# EAGLE design buckconverterhr (EAGLE 6.6.0)
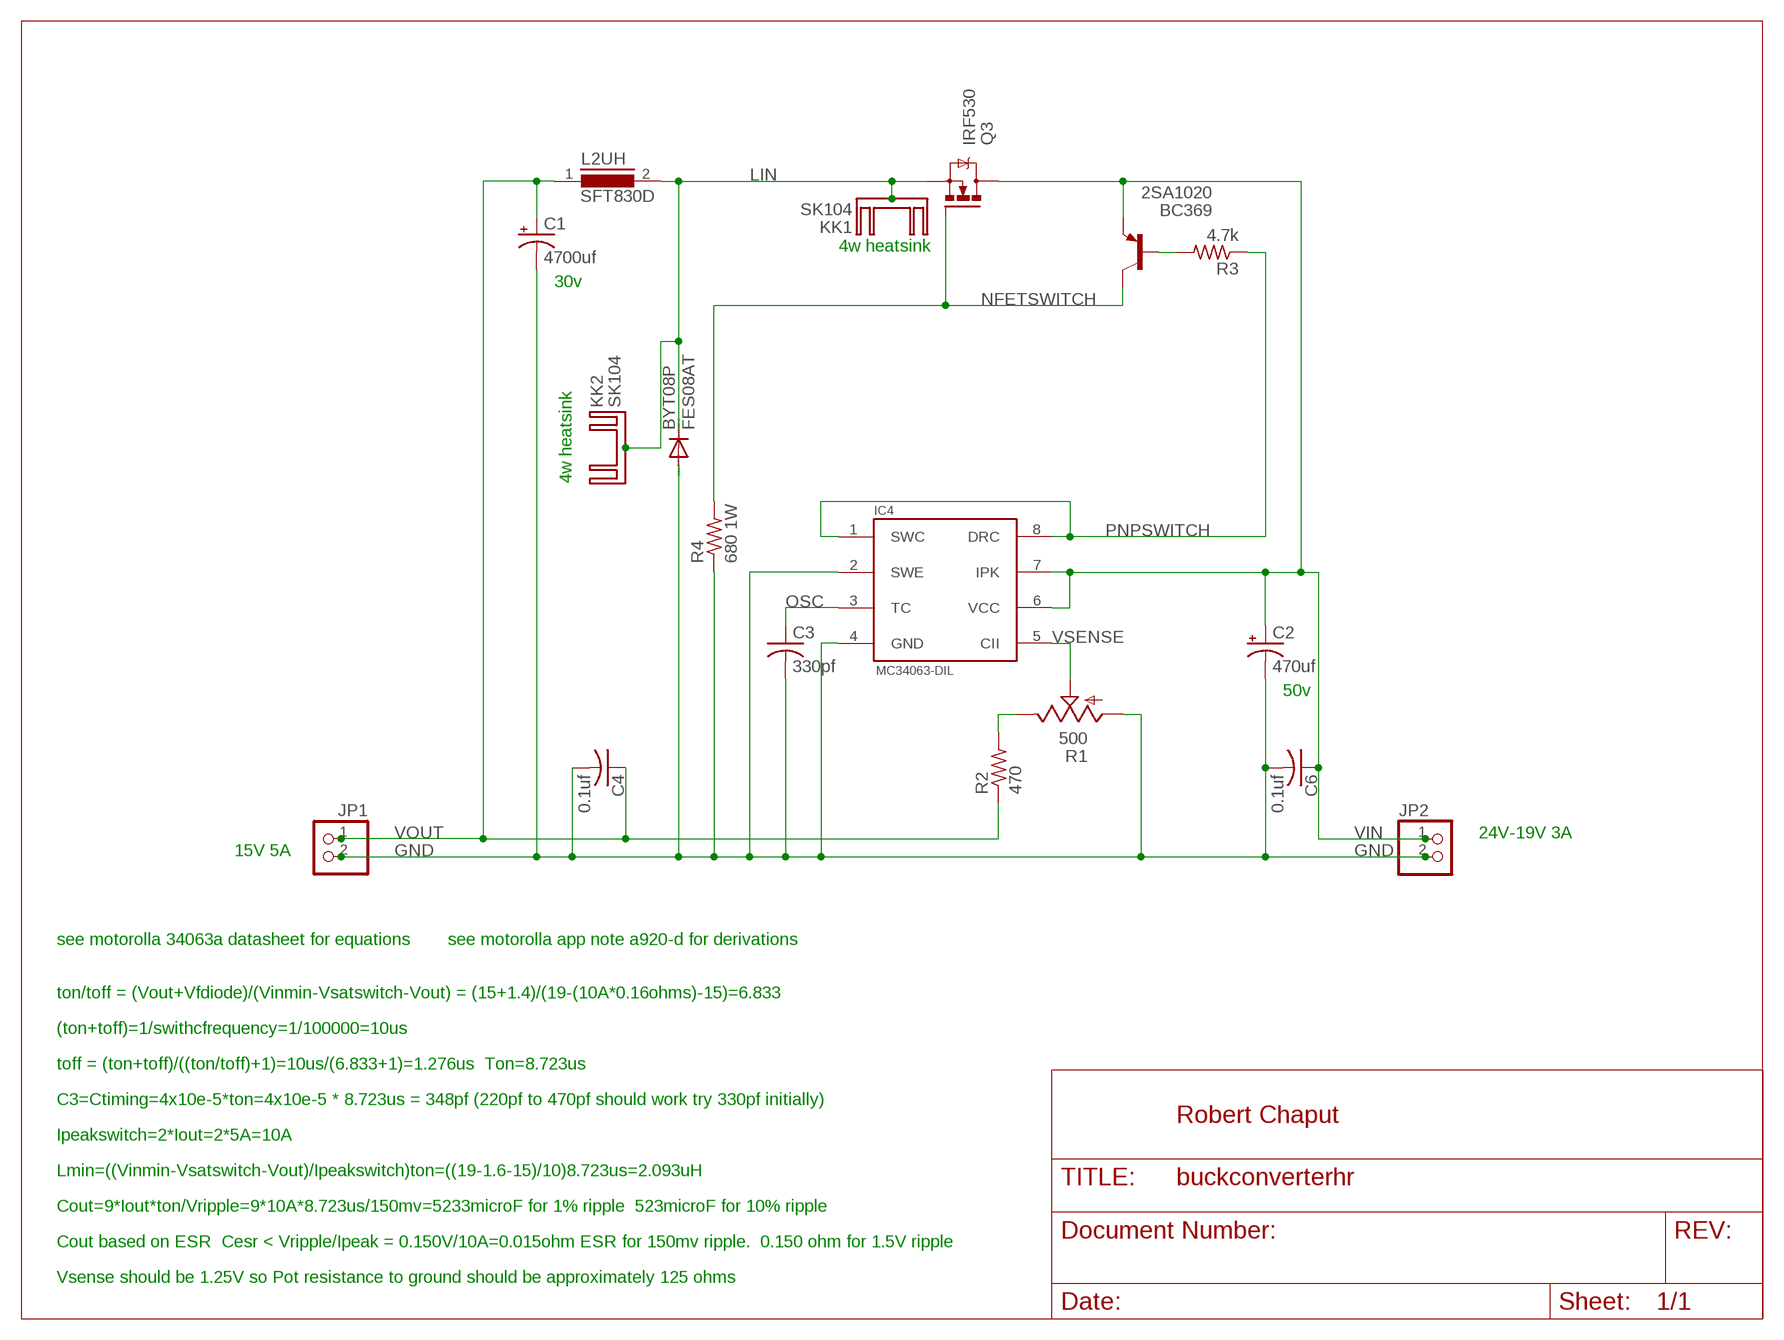
[diagram p0: schematic, sheet 1]

## Parts
2SA1020  BC369  [TO92-BCE]
BYT08P  FES08AT  [DO220S]
C1  4700uf  CPOL-USE10-30  [EB30D]
C2  470uf  CPOL-USE5-8.5  [E5-8,5]
C3  330pf  C-US050-030X075  [C050-030X075]
C4  0.1uf  C-US050-030X075  [C050-030X075]
C6  0.1uf  C-US050-030X075  [C050-030X075]
IC4  MC34063-DIL  [DIL08]
JP1  PINHD-1X2  [1X02]
JP2  PINHD-1X2  [1X02]
KK1  SK104  [SK104]
KK2  SK104  [SK104]
L2UH  SFT830D  [SFT830D]
Q3  IRF530  [TO220BV]
R1  500  TRIM_US-PTSPIN  [PT-SPIN]
R2  470  R-US_0309/V  [0309V]
R3  4.7k  R-US_0309/V  [0309V]
R4  680 1W  R-US_0613/5V  [P0613V]

## Nets
GND: BYT08P.A C1.- C2.- C3.2 C4.2 C6.2 IC4.2(SWE) IC4.4(GND) JP1.2 JP2.2 R1.A R4.1
LIN: BYT08P.C L2UH.2 Q3.S
N$1: R1.E R2.2
N$8: 2SA1020.B R3.2
NFETSWITCH: 2SA1020.C Q3.G R4.2
OSC: C3.1 IC4.3(TC)
PNPSWITCH: IC4.1(SWC) IC4.8(DRC) R3.1
VIN: 2SA1020.E C2.+ C6.1 IC4.6(VCC) IC4.7(IPK) JP2.1 Q3.D
VOUT: C1.+ C4.1 JP1.1 L2UH.1 R2.1
VSENSE: IC4.5(CII) R1.S

## Notes on the sheet
- 4w heatsink
- 30v
- 4w heatsink
- 50v
- 24V-19V 3A
- 15V 5A
- see motorolla 34063a datasheet for equations | see motorolla app note a920-d for derivations
- ton/toff = (Vout+Vfdiode)/(Vinmin-Vsatswitch-Vout) = (15+1.4)/(19-(10A*0.16ohms)-15)=6.833
- (ton+toff)=1/swithcfrequency=1/100000=10us
- toff = (ton+toff)/((ton/toff)+1)=10us/(6.833+1)=1.276us  Ton=8.723us
- C3=Ctiming=4x10e-5*ton=4x10e-5 * 8.723us = 348pf (220pf to 470pf should work try 330pf initially)
- Robert Chaput
- Ipeakswitch=2*Iout=2*5A=10A
- Lmin=((Vinmin-Vsatswitch-Vout)/Ipeakswitch)ton=((19-1.6-15)/10)8.723us=2.093uH
- Cout=9*Iout*ton/Vripple=9*10A*8.723us/150mv=5233microF for 1% ripple  523microF for 10% ripple
- Cout based on ESR  Cesr < Vripple/Ipeak = 0.150V/10A=0.015ohm ESR for 150mv ripple.  0.150 ohm for 1.5V ripple
- Vsense should be 1.25V so Pot resistance to ground should be approximately 125 ohms

## Library data of the parts
2SA1020 = transistor-pnp:BC369*: PNP Transistror
BYT08P = diode:FES08AT: DIODE ultra-fast recovery rectifier
C1 C2 = rcl:CPOL-US: POLARIZED CAPACITOR, American symbol
C3 C4 C6 = rcl:C-US: CAPACITOR, American symbol
IC4 = mc34063:MC34063-DIL: DC/DC converter MC34063 in DIL08.
JP1 JP2 = pinhead:PINHD-1X2: PIN HEADER
KK1 KK2 = heatsink:SK104: HEATSINK manufacturer Fischer/distributor Buerklin
L2UH = inductors:SFT830D: INDUCTOR
Q3 = transistor-power:IRF530: HEXFET Power MOSFET
R1 = pot:TRIM_US-: POTENTIOMETER
R2-R4 = rcl:R-US_: RESISTOR, American symbol

## Net classes
0 default: width 1.27 mm

## Board
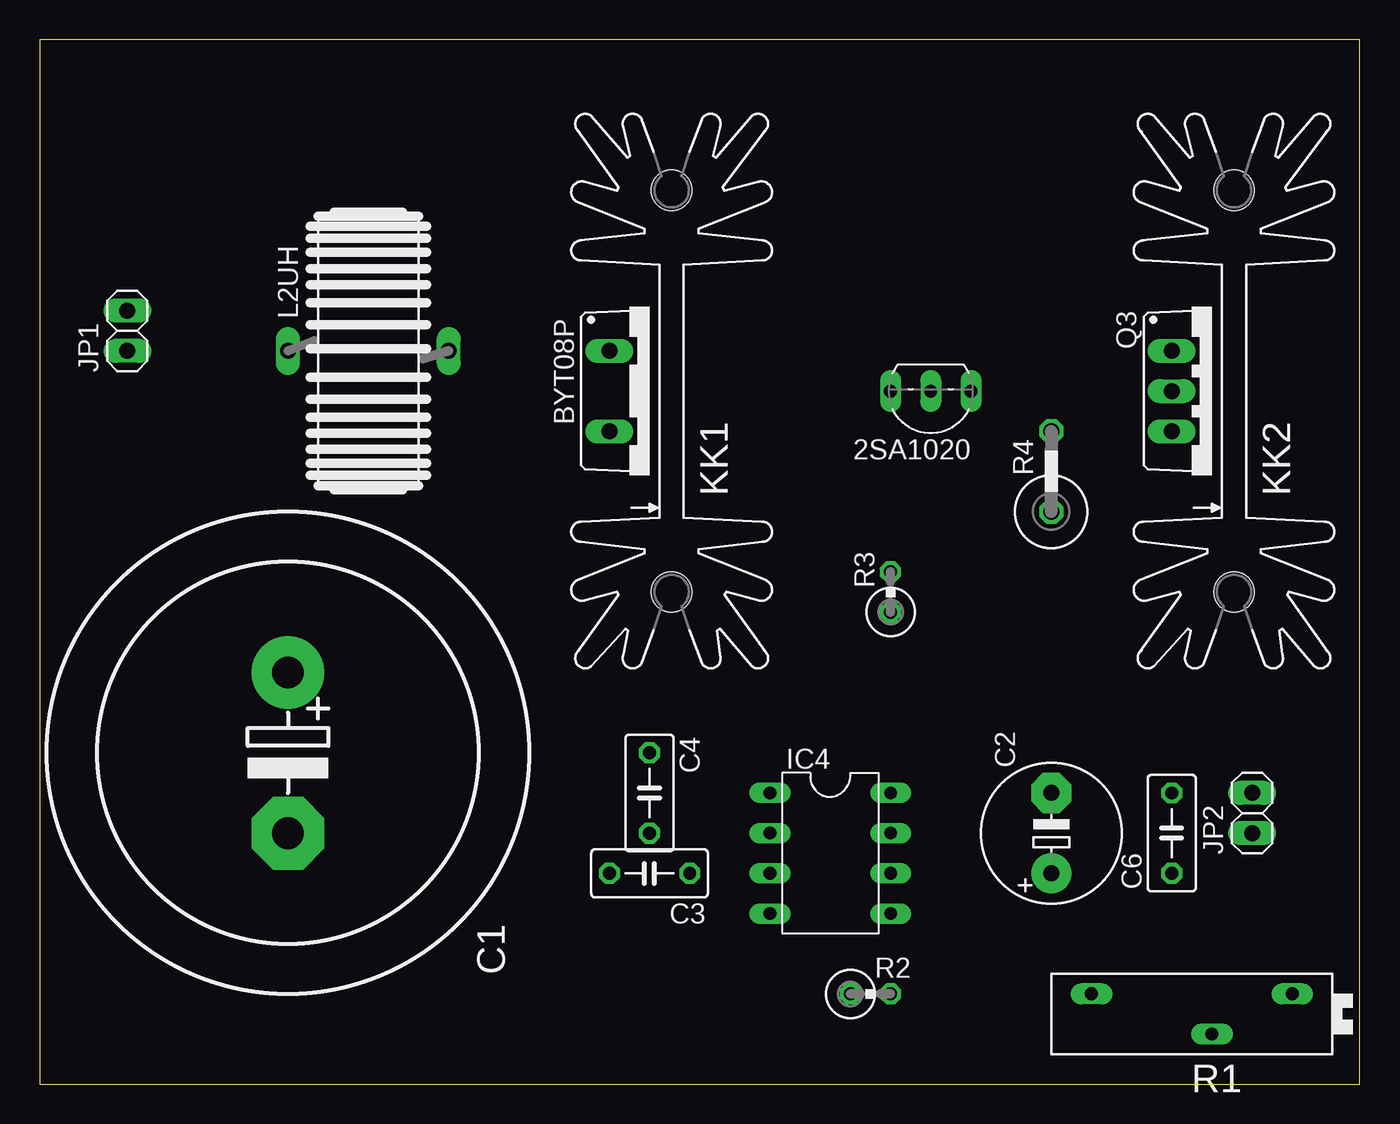
[diagram p1: board, top side]
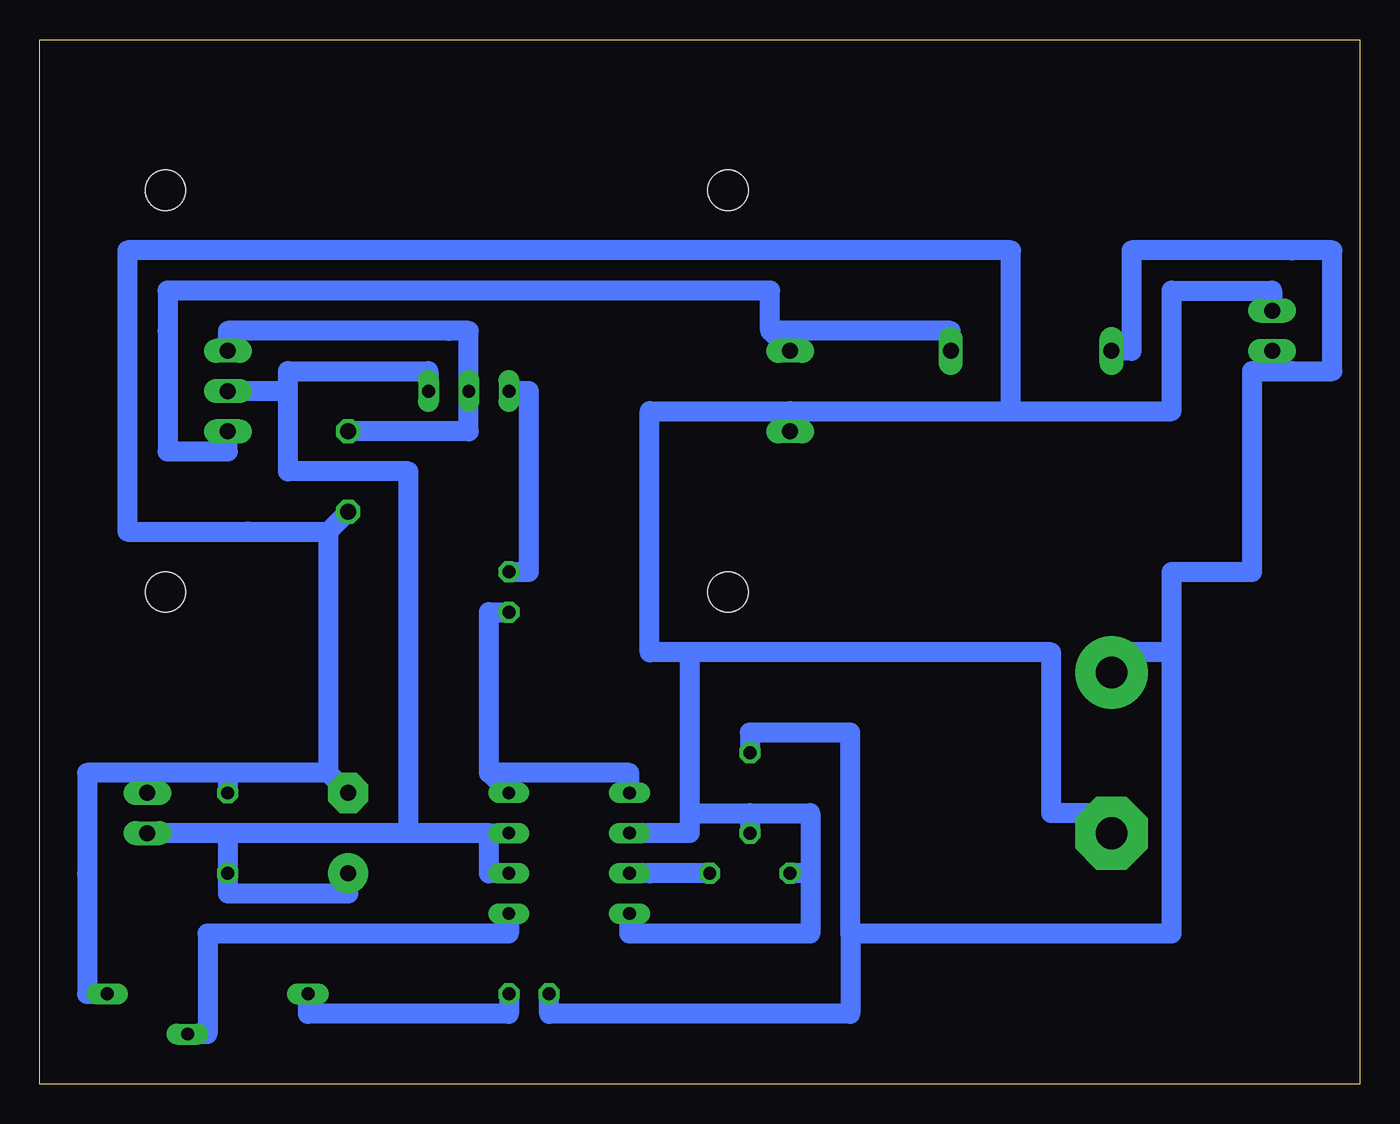
[diagram p2: board, bottom side, seen from below]

Size 83.49 x 66.03 mm. Coordinates in mm from the lower left corner, seen from the top.
Outline: 0,0 83.49,0 83.49,66.03 0,66.03 0,0
Copper layers (1*16): Top 0.035mm / dielectric 1.5mm / Bottom 0.035mm
Design rules "15mils": minimum track width 15mil, minimum drill 24mil, track to track 15mil, track to pad 10mil, pad to pad 10mil, via to via 10mil, smd to smd 10mil, copper to edge 13mil, drill to drill 10mil, minimum pad ring 10mil, minimum via ring 8mil, stop-mask expansion 0mil, vias tented up to drill 0mil, thermal gap 10mil

### Footprints (pad centres in the part's own frame; a part is rotated, then mirrored left to right if it is on the bottom)
TO92-BCE = drill 0.813 long: B 2.54,0; C 0,0; E -2.54,0
DO220S = drill 1.016 long: A 2.54,-2.54; C -2.54,-2.54
EB30D = drill 2.007 pad 4.597: + -5.08,0 | drill 2.007 pad 4.597 octagon: - 5.08,0
E5-8,5 = drill 1.016 pad 2.54: + -2.54,0 | drill 1.016 pad 2.54 octagon: - 2.54,0
C050-030X075 = drill 0.813 octagon: 1 -2.54,0; 2 2.54,0
DIL08 = drill 0.8 long: 1 -3.81,-3.81; 2 -1.27,-3.81; 3 1.27,-3.81; 4 3.81,-3.81; 5 3.81,3.81; 6 1.27,3.81; 7 -1.27,3.81; 8 -3.81,3.81
1X02 = drill 1.016 long: 1 -1.27,0; 2 1.27,0
SK104 = hole 2.54: -12.7,-0.762; 12.7,-0.762
SFT830D = drill 1.016 long: 1 -5.08,0; 2 5.08,0
TO220BV = drill 1.016 long: D 0,-2.54; G -2.54,-2.54; S 2.54,-2.54
PT-SPIN = drill 0.813 long: A -6.35,-1.27; E 6.35,-1.27; S -1.27,1.27
0309V = drill 0.813 octagon: 1 -1.27,0; 2 1.27,0
P0613V = drill 1.016 octagon: 1 -2.54,0; 2 2.54,0

### Placement (x,y rotation side)
2SA1020  56.35,43.81 180 top
BYT08P  38.57,43.81 270 top
C1  15.71,20.95 270 top
C2  63.97,15.87 90 top
C3  38.57,13.33 180 top
C4  38.57,18.41 270 top
C6  71.59,15.87 90 top
IC4  50,14.6 270 top
JP1  5.55,47.62 90 top
JP2  76.67,17.14 90 top
KK1  39.21,43.81 90 top
KK2  74.77,43.81 90 top
L2UH  20.79,46.35 0 top
Q3  74.13,43.81 270 top
R1  72.86,4.44 180 top
R2  52.54,5.71 0 top
R3  53.81,31.11 90 top
R4  63.97,38.73 90 top

### Tracks (layer width: path | path; a pad name or v marks a point on that pad's centre or on a via)
GND
  Bottom 1.27: 71.59,19.68 C6.2 71.59,19.68 | 71.59,19.68 76.67,19.68 | 76.67,19.68 JP2.2 76.67,19.68 | 76.67,19.68 80.48,19.68 80.48,13.33 80.48,5.71 R1.A | 65.24,34.92 R4.1 65.24,34.92 | 65.24,34.92 65.24,19.68 | 65.24,19.68 C2.- 65.24,19.68 | 65.24,19.68 71.59,19.68 | 34.76,13.33 C3.2 34.76,13.33 | 34.76,13.33 34.76,9.52 46.19,9.52 IC4.4 | 42.38,17.14 38.57,17.14 | 38.57,17.14 C4.2 38.57,17.14 | 42.38,17.14 42.38,15.87 IC4.2 | 36.03,42.54 44.92,42.54 44.92,27.3 | 42.38,27.3 44.92,27.3 | 42.38,27.3 42.38,17.14 | 36.03,42.54 BYT08P.A 36.03,42.54 | 36.03,42.54 22.06,42.54 | 22.06,42.54 11.9,42.54 11.9,50.16 5.55,50.16 JP1.2 | 38.57,17.14 34.76,17.14 34.76,13.33 | 42.38,27.3 19.52,27.3 19.52,17.14 16.98,17.14 C1.- | 42.38,27.3 44.92,27.3 | 65.24,34.92 70.32,34.92 77.94,34.92 77.94,47.62 77.94,52.7 22.06,52.7 22.06,42.54
LIN
  Bottom 1.27: L2UH.2 25.87,47.62 37.3,47.62 | 37.3,47.62 BYT08P.C 37.3,47.62 | 37.3,47.62 37.3,50.16 75.4,50.16 75.4,47.62 75.4,40 71.59,40 Q3.S
N$1
  Bottom 1.27: R2.2 53.81,4.44 66.51,4.44 R1.E
N$8
  Bottom 1.27: R3.2 52.54,32.38 52.54,43.81 2SA1020.B
NFETSWITCH
  Bottom 1.27: R4.2 56.35,41.27 2SA1020.C 56.35,47.62 57.62,47.62 71.59,47.62 Q3.G
OSC
  Bottom 1.27: C3.1 44.92,13.33 IC4.3
PNPSWITCH
  Bottom 1.27: 55.08,19.68 46.19,19.68 IC4.1 | 55.08,19.68 IC4.8 55.08,19.68 | 55.08,19.68 55.08,29.84 R3.1
VIN
  Bottom 1.27: 67.78,43.81 67.78,45.08 | 67.78,45.08 58.89,45.08 2SA1020.E | 67.78,43.81 Q3.D | C2.+ 63.97,12.06 71.59,12.06 C6.1 71.59,15.87 | 55.08,15.87 55.08,13.33 IC4.6 | 55.08,15.87 IC4.7 55.08,15.87 | 55.08,15.87 60.16,15.87 | 60.16,15.87 71.59,15.87 | 71.59,15.87 75.4,15.87 JP2.1 | 67.78,43.81 67.78,38.73 60.16,38.73 60.16,15.87 | 67.78,43.81 67.78,45.08
VOUT
  Bottom 1.27: R2.1 51.27,4.44 32.22,4.44 32.22,9.52 | 32.22,9.52 32.22,22.22 38.57,22.22 C4.1 | 5.55,45.08 6.82,45.08 6.82,32.38 11.9,32.38 | 11.9,27.3 11.9,32.38 | 5.55,45.08 JP1.1 5.55,45.08 | 11.9,27.3 14.44,27.3 C1.+ | 5.55,45.08 4.28,45.08 1.74,45.08 1.74,52.7 4.28,52.7 14.44,52.7 14.44,47.62 14.44,46.35 L2UH.1 | 32.22,9.52 16.98,9.52 11.9,9.52 11.9,27.3 | 11.9,27.3 11.9,32.38
VSENSE
  Bottom 1.27: IC4.5 53.81,9.52 72.86,9.52 72.86,3.17 R1.S